# EAGLE design MINI_SAM_TQFP_2.54_BB_2017_01_17_004 (EAGLE 7.6.0)
DESIGNER: BENJAMIN SHOCKLEY; REV: A
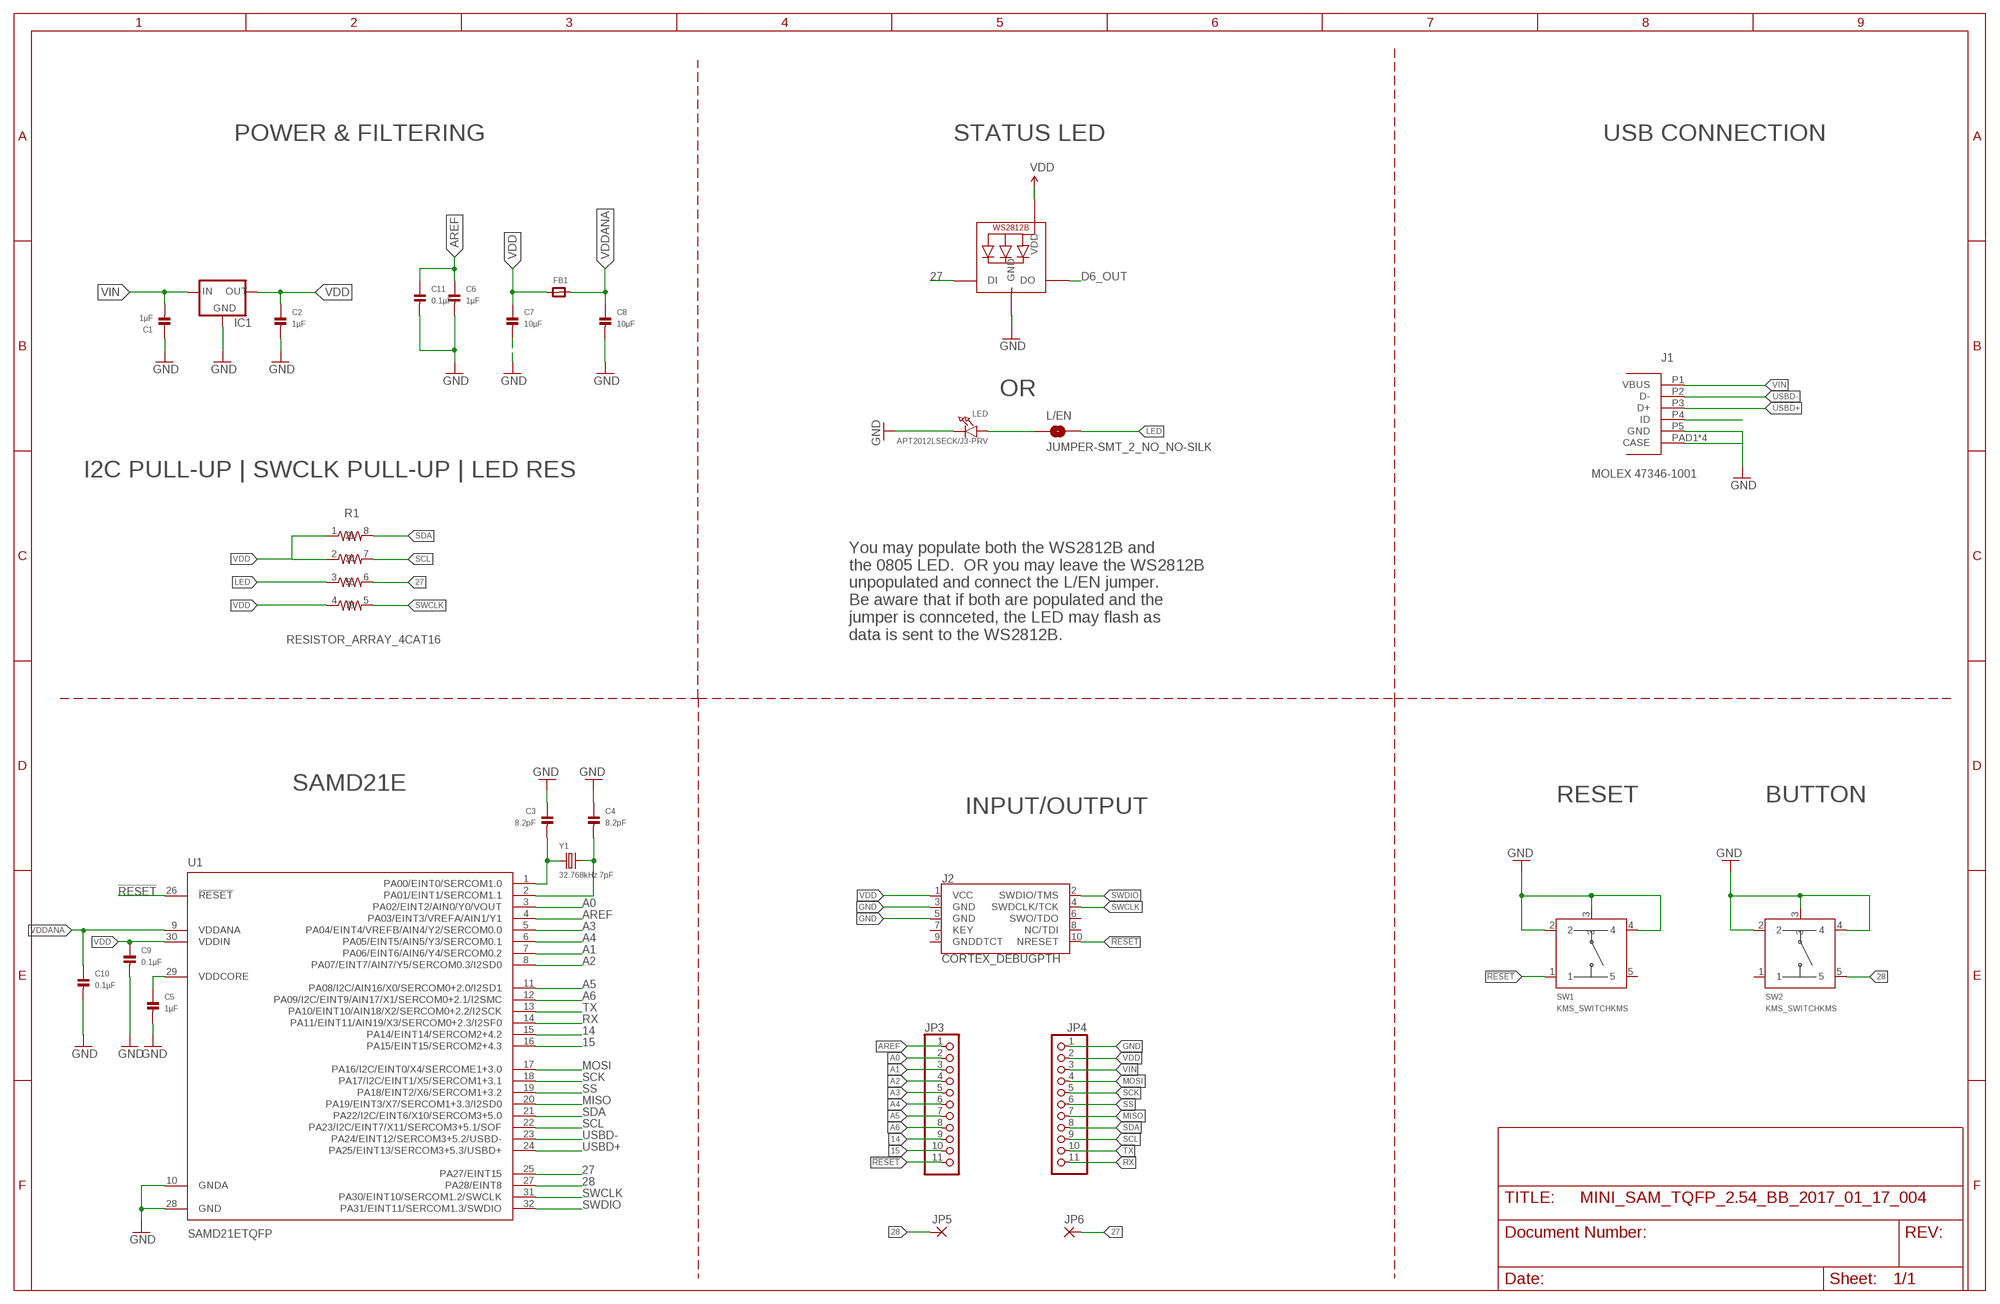
[diagram p0: schematic, sheet 1]

## Parts
C1  1µF  CAP_CERAMIC_0805MP  [_0805MP]
C2  1µF  CAP_CERAMIC_0805MP  [_0805MP]
C3  8.2pF  CAP_CERAMIC_0805MP  [_0805MP]
C4  8.2pF  CAP_CERAMIC_0805MP  [_0805MP]
C5  1µF  CAP_CERAMIC_0805MP  [_0805MP]
C6  1µF  CAP_CERAMIC_0805MP  [_0805MP]
C7  10µF  CAP_CERAMIC_0805MP  [_0805MP]
C8  10µF  CAP_CERAMIC_0805MP  [_0805MP]
C9  0.1µF  CAP_CERAMIC_0805MP  [_0805MP]
C10  0.1µF  CAP_CERAMIC_0805MP  [_0805MP]
C11  0.1µF  CAP_CERAMIC_0805MP  [_0805MP]
FB1  FERRITE_0805MP  [_0805MP]
IC1  MCP1700  [SOT23]
J1  MOLEX_47346-100147346  [MOLEX_47346-1001]
J2  CORTEX_DEBUGPTH  [2X5-PTH-1.27MM]
JP3  PINHD-1X111X11_SMT  [1X11_SMT]
JP4  PINHD-1X111X11_SMT  [1X11_SMT]
JP5  FR11_PAD2.5MMX1.5MM  [SMD2.5MMX1.5MM]
JP6  FR11_PAD2.5MMX1.5MM  [SMD2.5MMX1.5MM]
L/EN  JUMPER-SMT_2_NO_NO-SILK  [SMT-JUMPER_2_NO_NO-SILK]
LED  APT2012LSECK/J3-PRV  LED0805_NOOUTLINE  [CHIPLED_0805_NOOUTLINE]
R1  RESISTOR_ARRAY_4CAT16  [CAT16_ARRAY]
STATUS  WS2812B3535  [LED3535]
SW1  KMS_SWITCHKMS  [KMS_SWITCH]
SW2  KMS_SWITCHKMS  [KMS_SWITCH]
U1  SAMD21ETQFP  [TQFP32-08]
Y1  32.768kHz 7pF  CRYSTAL0805PACKAGE  [_0805MP]

## Nets
14: JP3.9 U1.15(PA14/EINT14/SERCOM2+4.2)
15: JP3.10 U1.16(PA15/EINT15/SERCOM2+4.3)
27: JP6.P$1(P) R1.6 STATUS.1(DI) U1.25(PA27/EINT15)
28: JP5.P$1(P) SW2.5 U1.27(PA28/EINT8)
!RESET: J2.10(NRESET) JP3.11 SW1.1 U1.26(!RESET)
A0: JP3.2 U1.3(PA02/EINT2/AIN0/Y0/VOUT)
A1: JP3.3 U1.7(PA06/EINT6/AIN6/Y4/SERCOM0.2)
A2: JP3.4 U1.8(PA07/EINT7/AIN7/Y5/SERCOM0.3/I2SD0)
A3: JP3.5 U1.5(PA04/EINT4/VREFB/AIN4/Y2/SERCOM0.0)
A4: JP3.6 U1.6(PA05/EINT5/AIN5/Y3/SERCOM0.1)
A5: JP3.7 U1.11(PA08/I2C/AIN16/X0/SERCOM0+2.0/I2SD1)
A6: JP3.8 U1.12(PA09/I2C/EINT9/AIN17/X1/SERCOM0+2.1/I2SMC)
AREF: C6.1 C11.1 JP3.1 U1.4(PA03/EINT3/VREFA/AIN1/Y1)
D6_OUT: STATUS.3(DO)
GND: C1.1 C2.2 C3.1 C4.1 C5.2 C6.2 C7.2 C8.2 C9.2 C10.2 C11.2 IC1.1(GND) J1.P5(GND) J1.PAD1(CASE) J1.PAD2(CASE) J1.PAD3(CASE) J1.PAD4(CASE) J2.3(GND) J2.5(GND) JP4.1 LED.C STATUS.4(GND) SW1.2 SW1.3 SW1.4 SW2.2 SW2.3 SW2.4 U1.10(GNDA) U1.28(GND)
LED: L/EN.2 R1.3
MISO: JP4.7 U1.20(PA19/EINT3/X7/SERCOM1+3.3/I2SD0)
MOSI: JP4.4 U1.17(PA16/I2C/EINT0/X4/SERCOME1+3.0)
N$1: C3.2 U1.1(PA00/EINT0/SERCOM1.0) Y1.1
N$2: L/EN.1 LED.A
N$5: C4.2 U1.2(PA01/EINT1/SERCOM1.1) Y1.2
N$9: C5.1 U1.29(VDDCORE)
N$10: J1.P4(ID)
RX: JP4.11 U1.14(PA11/EINT11/AIN19/X3/SERCOM0+2.3/I2SF0)
SCK: JP4.5 U1.18(PA17/I2C/EINT1/X5/SERCOM1+3.1)
SCL: JP4.9 R1.7 U1.22(PA23/I2C/EINT7/X11/SERCOM3+5.1/SOF)
SDA: JP4.8 R1.8 U1.21(PA22/I2C/EINT6/X10/SERCOM3+5.0)
SS: JP4.6 U1.19(PA18/EINT2/X6/SERCOM1+3.2)
SWCLK: J2.4(SWDCLK/TCK) R1.5 U1.31(PA30/EINT10/SERCOM1.2/SWCLK)
SWDIO: J2.2(SWDIO/TMS) U1.32(PA31/EINT11/SERCOM1.3/SWDIO)
TX: JP4.10 U1.13(PA10/EINT10/AIN18/X2/SERCOM0+2.2/I2SCK)
USBD+ [USB_DATA]: J1.P3(D+) U1.24(PA25/EINT13/SERCOM3+5.3/USBD+)
USBD- [USB_DATA]: J1.P2(D-) U1.23(PA24/EINT12/SERCOM3+5.2/USBD-)
VDD: C2.1 C7.1 C9.1 FB1.1 IC1.2(OUT) J2.1(VCC) JP4.2 R1.1 R1.2 R1.4 STATUS.2(VDD) U1.30(VDDIN)
VDDANA: C8.1 C10.1 FB1.2 U1.9(VDDANA)
VIN: C1.2 IC1.3(IN) J1.P1(VBUS) JP4.3
Unconnected: J2.6(SWO/TDO) J2.7(KEY) J2.8(NC/TDI) J2.9(GNDDTCT) SW1.5 SW2.1

## Notes on the sheet
- POWER & FILTERING | STATUS LED | USB CONNECTION
- OR
- I2C PULL-UP | SWCLK PULL-UP | LED RES | MOLEX 47346-1001
- You may populate both the WS2812B and
  the 0805 LED.  OR you may leave the WS2812B
  unpopulated and connect the L/EN jumper.
  Be aware that if both are populated and the
  jumper is connceted, the LED may flash as
  data is sent to the WS2812B.
- SAMD21E
- RESET | BUTTON
- INPUT/OUTPUT

## Library data of the parts
C1-C11 = microbuilder:CAP_CERAMIC: Ceramic Capacitors 0402 - 0402 Surface Mount Capacitors 16pF 50V 5% [Digikey: 445-4899-2-ND] 18pF 50V 5% [Digikey: 490-1281-2-ND] 22pF 50V 5% [Digikey: 490-1283-2-ND] 68pF 50V 5% [Digikey: 490-1289-2-ND] 0.1uF 10V 10% [Digikey: 490-1318-2-ND] 1.0uF 6.3V 10% [Digikey: 490-1320-2-ND] 0603 - 0603 Surface Mount Capacitors 16 pF 50V 5% [Digikey: 445-5051-2-ND] 22 pF 50V [Digikey: PCC220ACVTR-ND] 33 pF 50V 5% [Digikey: 490-1415-1-ND] 56pF 50V 5% [Digikey: 490-1421-1-ND] 220pF 50V 5% [Digikey: 445-1285-1-ND] 680 pF 50V 2200 pF 50V 5% C0G [Digikey: 445-1297-1-ND] 5600 pF 100V 5% X7R [Digikey: 478-3711-1-ND] 0.1 µF 25V 10% [Digikey: PCC2277TR-ND] 0.22 µF 16V 10% X7R [Digikey: 445-1318-1-ND] 1.0 µF 25V 10% [Digikey: 445-5146-2-ND] 0603 - RF Specific 3pF 250V +/-0.1pF RF [Digikey: 712-1347-1-ND] 18 pF 250V 5% [Digikey: 478-3505-1-ND or 712-1322-1-ND] 56 pF 250V 5% C0G RF [Digikey: 490-4867-1-ND] 68 pF 250V RF [Digikey: 490-4868-1-ND] 0805 - 0805 Surface Mount Capacitors 220 pF 250V 2% RF Ceramic Capacitor [Digikey: 712-1398-1-ND] 1000 pF 50V 2% NP0 Ceramic Capacitor [Digikey: 478-3760-1-ND] 0.1 µF 25V 10% Ceramic Capacitor [Digikey: PCC1828TR-ND] 1.0 µF 16V 10% Ceramic Capacitor[Digikey: 490-1691-2-ND] 10.0 µF 10V 10% Ceramic Capacitor[Digikey: 709-1228-1-ND] 10.0 uF 16V 10% Ceramic Capacitor [Digikey: 478-5165-2-ND] 47 uF 6.3V 20% Ceramic Capacitor [Digikey: 587-1779-1-ND or 399-5506-1-ND] 1206 - 1206 Surface Mount Capacitors 47uF 10V 20% Ceramic Capacitor [Digikey: 490-5528-1-ND or 399-5508-1-ND or 445-6010-1-ND] 100uF 6.3V -20%, +80% Y5V Ceramic Capacitor (Digikey: 490-4512-1-ND, Mouser: 81-GRM31CF50J107ZE1L)
FB1 = microbuilder:FERRITE: Ferrite Bead 0603 MMZ1608B121C - 120 Ohm @ 100MHz, 600mA, 0.15 Ohm DC Resistance - Digikey: 445-2164-1-ND BK1608HW121-T - 120 Ohm, 600mA Ferrite Chip - Digikey: 587-1876-2-ND 0805 HZ0805B272R-10 - 2.7K Ohm @ 100MHz, 200mA, 0.8 Ohm DC Resistance - Digikey: 240-2504-1-ND (see also Murata BLM21BD272SN1L) MMZ2012Y152B - 1.5K Ohm @ 100MHz, 500mA, 0.4 Ohm DC Resistance - Digikey: 445-1560-1-ND - Mainly for high frequency (80-400MHz) MMZ2012R102A - 1K Ohm @ 100MHz, 500mA, 0.3 Ohm DC Resistance - Digikey: 445-1555-2-ND - More general purpose (10-200MHz)
IC1 = Shockley_Custom:MCP1700: VOLTAGE REGULATOR
J1 = Shockley_Custom:MOLEX_47346-1001
J2 = SparkFun-Connectors:CORTEX_DEBUG: Cortex Debug Connector Datasheet <http://infocenter.arm.com/help/topic/com.arm.doc.faqs/attached/13634/cortex_debug_connectors.pdf>
JP3 JP4 = pinhead+:PINHD-1X11: PIN HEADER
JP5 JP6 = Shockley_Custom:FR11_PAD
L/EN = SparkFun-Jumpers:JUMPER-SMT_2_NO: Normally open jumper This jumper has two pads in close proximity to each other. Apply solder to close the connection. Round pads are easier to solder for beginners, but are a lot larger. SparkFun Product that uses the round pads: SparkFun EL Sequencer <https://www.sparkfun.com/products/12781>
LED = microbuilder:LED: LED 0603 - 0603 Surface Mount Package 2mA: Green LED - Low Power (3.9mcd, 2ma, 1.7Vf) - Digikey: 475-2709-2-ND Orange LED - Low Power (9.8mcd, 2ma, 1.8Vf) - Digikey: 475-1194-2-ND Red LED - Low Power (5mcd, 2ma, 1.8Vf) - Digikey: 475-1195-2-ND Yellow LED - Low Power (7mcd, 2ma, 1.8Vf) - Digikey: 475-1196-2-ND 5mA: Blue LED - Low Power (17mcd, 5ma, 2.9Vf) - Digikey: LNJ937W8CRACT-ND 0805 - 0805 Surface Mount Package 2mA: Red LED (8.8mcd, 2mA, 1.8Vf, Clear) - Low Power [Digikey: 475-2510-1-ND] Green LED (5mcd, 2mA, 1.8Vf, Clear) - Low Power [Digikey: 475-2730-1-ND] Yellow LED (11.3mcd, 2mA, 1.8Vf, Clear) - Low Power [Digikey: 475-2555-1-ND] 20mA: Red LED (104mcd, 20mA, Diffused) - LS R976 [Digikey: 475-1278-6-ND] Red LED (12mcd, 20mA, 2.0Vf, Clear) - APT2012EC [Digikey: 754-1128-1-ND] Green LED (15mcd, 20mA, 2.2Vf, Clear) - APT2012GC [Digikey: 754-1131-1-ND] Orange LED (160mcd, 20mA, 2.1Vf, Clear) - APT2012SECK [Digikey: 754-1130-1-ND] 1206 - 1206 Surface Mount Package Green LED (26mcd, 20mA, Diffused) - LG N971 [Digikey: 475-1407-6-ND] Red LED (15mcd, 20mA, Diffused) - LH N974 [Digikey: 475-1416-6-ND]
R1 = Shockley_Custom:RESISTOR_ARRAY_4
STATUS = adafruit:WS2812B
SW1 SW2 = Shockley_Custom:KMS_SWITCH
U1 = Shockley_Custom:SAMD21E
Y1 = Shockley_Custom:CRYSTAL: Crystals HC49UP - Surface Mount Crystal 4.0MHz 18pF +/-30ppm Surface Mount Crystal [Digikey: 535-9857-1-ND] 12.0 MHz Surface Mount Crystal [Digikey: 535-9869-6-ND] 25.0 MHz Surface Mount Crystal [Digikey: 535-9078-1-ND] 2.5 x 2.0mm - MEMs SMT Crystal 16.0 MHz 10pF 20ppm 2.5 x 2.0mm Crystal [Digikey -40-85°C: 535-10923-1-ND] 3.2 x 2.5mm - MEMs SMT Crystal 12.0 MHz 8pF 15ppm 3.2 x 2.5mm Crystal [Digikey: -10-70°C: 644-1047-1-ND -40-125°C: 644-1128-1-ND] 16.0 MHz 8pF 15ppm 3.2 x 2.5mm Crystal [Digikey: -10-70°C: 644-1049-1-ND -40-125°C: 644-1129-2-ND] 16.0 MHz 10pF 10ppm 3.2 x 2.5mm Crystal [Digikey: 644-1100-1-ND] 27.12 MHz 18pF 30ppm 3.2 x 2.5mm Crystal [Digikey: 887-1424-1-ND] 27.12MHz 10pF 10ppm 3.2 x 2.5mm Crystal [Digikey: 887-1329-1-ND] 4.9 x 1.8mm - MEMs SMT Crystal 32.768 KHz 12.5pF 20ppm 4.9 x 1.8mm Crystal [Digikey: SE2415CT-ND] 8.0 x 3.8mm - Surface Mount Crystal 32.768kHz 12.5pF 20ppm -40°C-85°C [Digikey: 535-9166-2-ND] Cylinder 32.768KHz Cylinder Crystal (2x6mm body) [Ex. Digikey: 300-8341-2-ND]

## Board
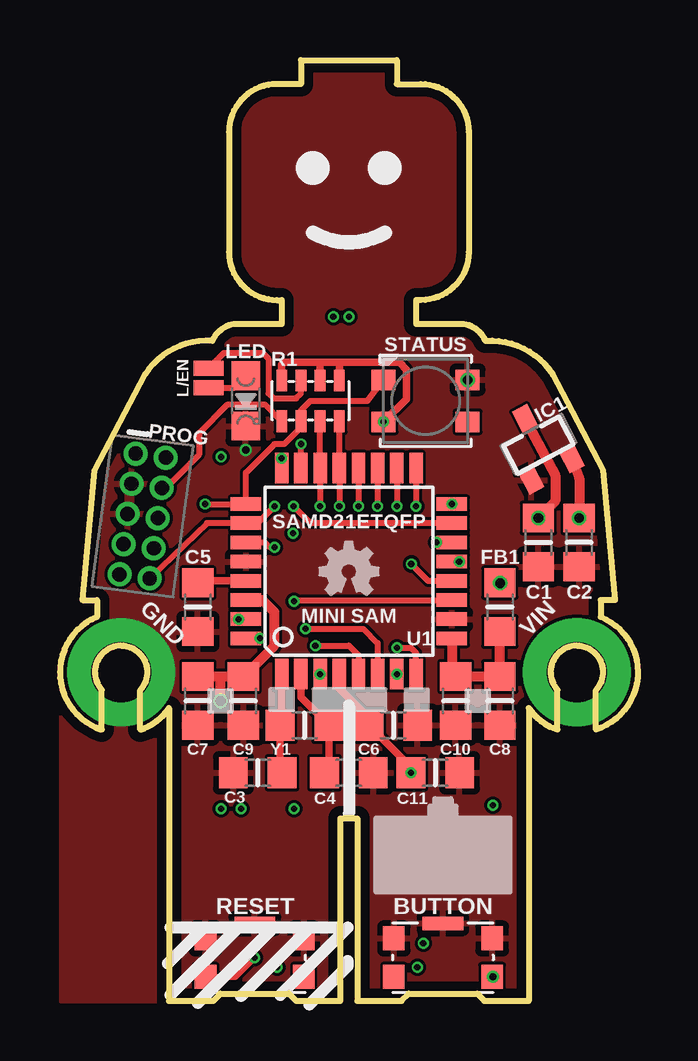
[diagram p1: board, top side]
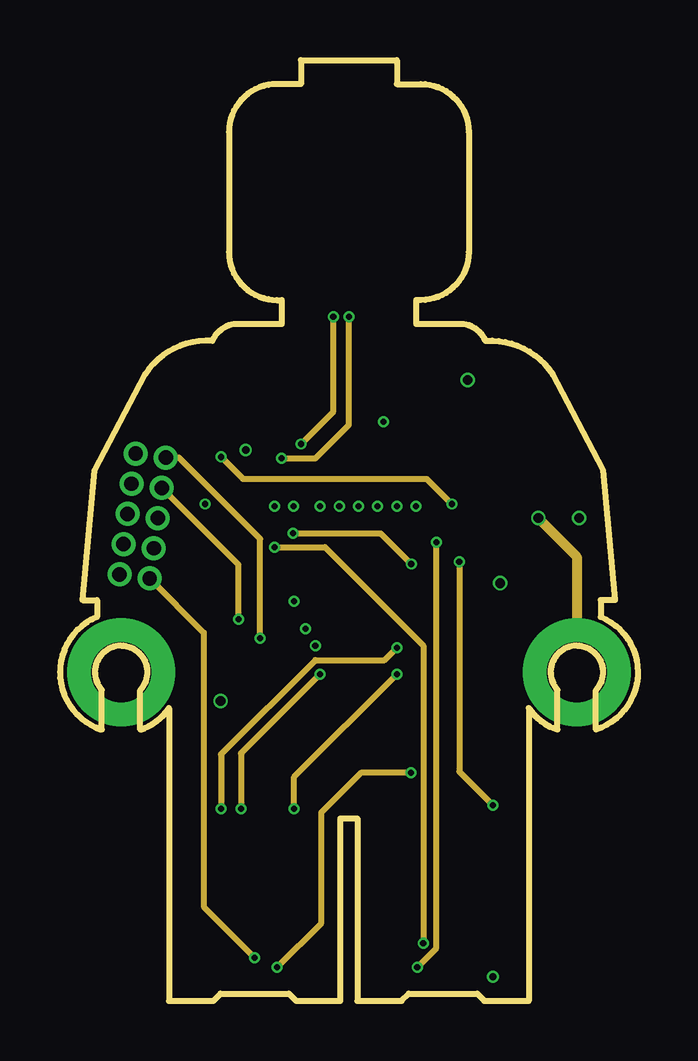
[diagram p2: board, inner layer Route2]
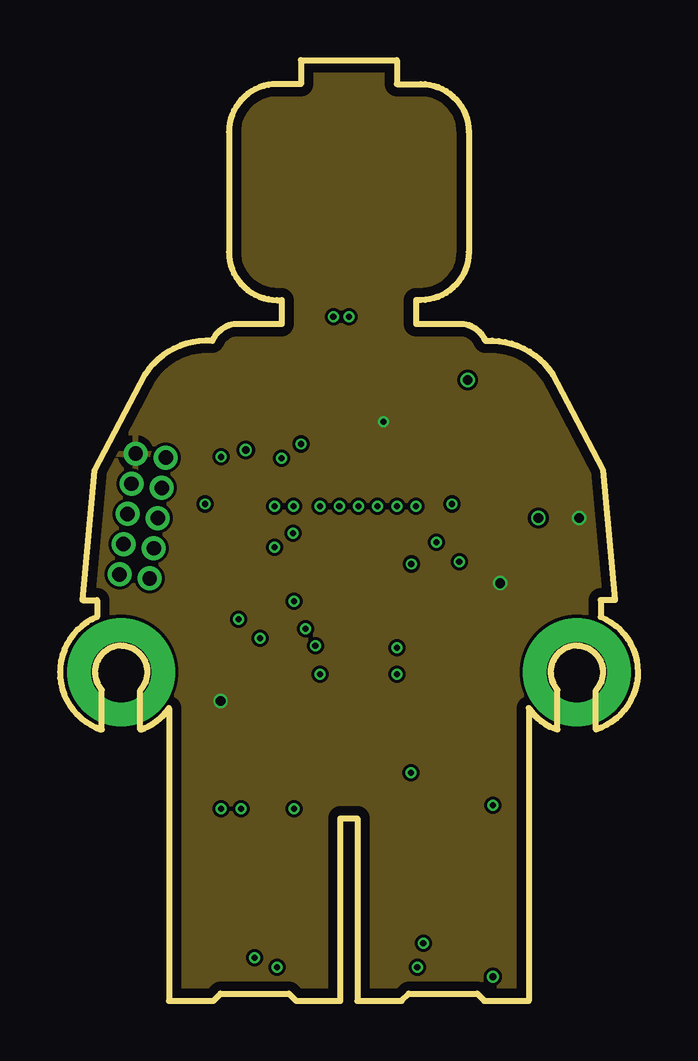
[diagram p3: board, inner layer Route15]
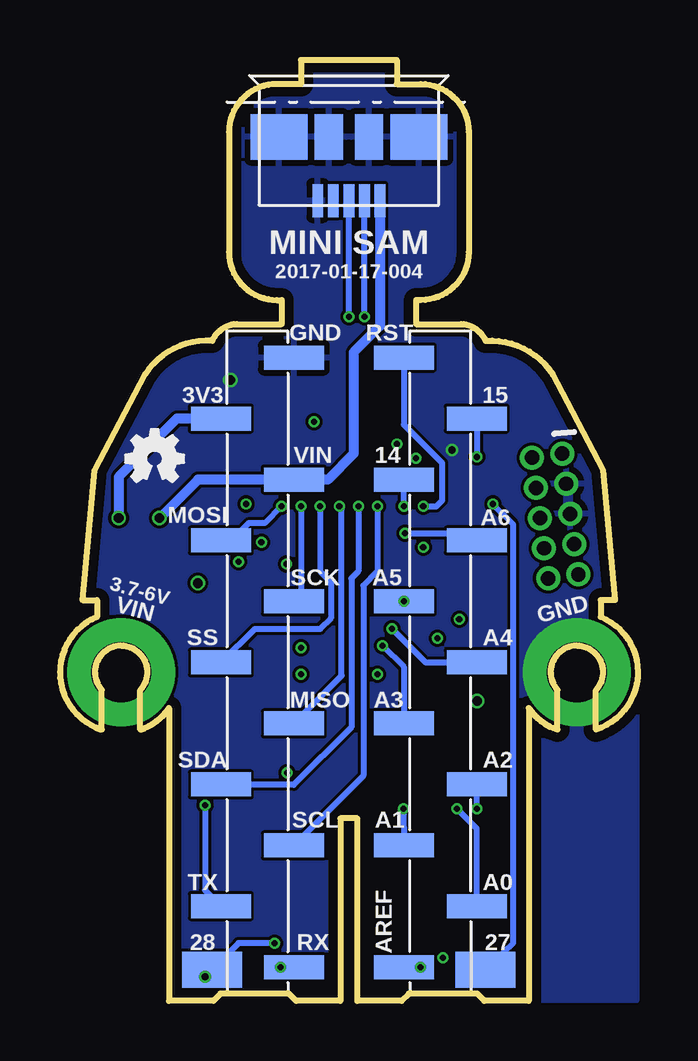
[diagram p4: board, bottom side, seen from below]

Size 24.1 x 39.2 mm. Coordinates in mm from the lower left corner, seen from the top.
Outline: 4.55,12.2 4.55,0 6.4,0 6.7,0.3 9.55,0.3 9.85,0 11.7,0 11.7,7.6 12.4,7.6 12.4,0 14.25,0 14.55,0.3 17.4,0.3 17.7,0 19.55,0 19.55,12.2
Outline: 4.55,12.2 arc-28 3.65,11.4
Outline: 4.55,12.2 arc-40 3.35,11.3 3.35,12.95 arc132 2.55,14.8 arc132 1.75,12.95 1.75,11.3 arc-140 1.55,16 1.55,16.7 0.95,16.7 1.45,22.1 3.55,26.1 arc-60 6.35,27.5 arc-63 7.37,28.2 9.25,28.2 9.25,29.2 9.05,29.2 arc-90 7.05,31.2 7.05,36.2 arc-90 9.05,38.2 10.05,38.2 10.05,39.2 14.05,39.2 14.05,38.2 15.05,38.2 arc-90 17.05,36.2 17.05,31.2 arc-90 15.05,29.2 14.85,29.2 14.85,28.2 16.73,28.2 arc-63 17.75,27.5 arc-60 20.55,26.1 22.65,22.1 23.15,16.7 22.55,16.7 22.55,16 arc-140 22.35,11.3 22.35,12.95 arc132 21.55,14.8 arc132 20.75,12.95 20.75,11.3 arc-40 19.55,12.2
Outline: 19.55,12.2 arc28 20.45,11.4
Copper layers (1*2*15*16): Top 0.035559375mm / dielectric 0.17018125mm / Route2 0.01778125mm / dielectric 47mil / Route15 0.01778125mm / dielectric 0.17018125mm / Bottom 0.035559375mm
Design rules "OSHPark-4layer *": minimum track width 5mil, minimum drill 10mil, track to track 5mil, track to pad 5mil, pad to pad 5mil, via to via 5mil, smd to smd 5mil, copper to edge 15mil, drill to drill 6mil, minimum pad ring 4mil, minimum via ring 4mil, stop-mask expansion 2.5mil, vias tented up to drill 28mil, thermal gap 10mil

### Footprints (pad centres in the part's own frame; a part is rotated, then mirrored left to right if it is on the bottom)
_0805MP = smd 1.2 x 1.3: 1 -1.016,0; 2 1.016,0
SOT23 = smd 0.7 x 1: 1 -0.95,-1.2; 2 0.95,-1.2; 3 0,1.2
MOLEX_47346-1001 = smd 0.45 x 1.38: P1 1.3,-2.66; P2 0.65,-2.66; P3 0,-2.66; P4 -0.65,-2.66; P5 -1.3,-2.66 | smd 2.375 x 1.9: PAD1 -2.913,0; PAD4 2.913,0 | smd 1.175 x 1.9: PAD2 -0.838,0; PAD3 0.838,0
2X5-PTH-1.27MM = drill 0.6 pad 1: 1 -2.54,-0.635; 2 -2.54,0.635; 3 -1.27,-0.635; 4 -1.27,0.635; 5 0,-0.635; 6 0,0.635; 7 1.27,-0.635; 8 1.27,0.635; 9 2.54,-0.635; 10 2.54,0.635
1X11_SMT = smd 1 x 2.5: 1 -12.7,1.52; 2 -10.16,-1.52; 3 -7.62,1.52; 4 -5.08,-1.52; 5 -2.54,1.52; 6 0,-1.52; 7 2.54,1.52; 8 5.08,-1.52; 9 7.62,1.52; 10 10.16,-1.52; 11 12.7,1.52
SMD2.5MMX1.5MM = smd 1.5 x 2.5: P$1 0,0
SMT-JUMPER_2_NO_NO-SILK = smd 0.635 x 1.27: 1 -0.406,0; 2 0.406,0
CHIPLED_0805_NOOUTLINE = smd 1.2 x 1.2: A 0,-1.05; C 0,1.05
CAT16_ARRAY = smd 0.45 x 0.9: 1 -1.2,-0.85; 2 -0.4,-0.85; 3 0.4,-0.85; 4 1.2,-0.85; 5 1.2,0.85; 6 0.4,0.85; 7 -0.4,0.85; 8 -1.2,0.85
LED3535 = smd 1 x 0.85: 1 -1.75,0.875; 2 -1.75,-0.875; 3 1.75,-0.875; 4 1.75,0.875
KMS_SWITCH = smd 0.9 x 1: 1 -2.05,-0.8; 2 -2.05,0.8; 4 2.05,0.8; 5 2.05,-0.8 | smd 1.7 x 0.55: 3 0,1.425
TQFP32-08 = smd 1.27 x 0.559: 1 -4.293,2.8; 2 -4.293,2; 3 -4.293,1.2; 4 -4.293,0.4; 5 -4.293,-0.4; 6 -4.293,-1.2; 7 -4.293,-2; 8 -4.293,-2.8; 17 4.293,-2.8; 18 4.293,-2; 19 4.293,-1.2; 20 4.293,-0.4; 21 4.293,0.4; 22 4.293,1.2; 23 4.293,2; 24 4.293,2.8 | smd 0.559 x 1.27: 9 -2.8,-4.293; 10 -2,-4.293; 11 -1.2,-4.293; 12 -0.4,-4.293; 13 0.4,-4.293; 14 1.2,-4.293; 15 2,-4.293; 16 2.8,-4.293; 25 2.8,4.293; 26 2,4.293; 27 1.2,4.293; 28 0.4,4.293; 29 -0.4,4.293; 30 -1.2,4.293; 31 -2,4.293; 32 -2.8,4.293

### Placement (x,y rotation side)
C1  19.95,19.1 90 top
C2  21.65,19.1 270 top
C3  8.25,9.5 0 top
C4  12.05,9.5 180 top
C5  5.75,16.4 270 top
C6  13.9,11.48 0 top
C7  5.75,12.5 270 top
C8  18.35,12.5 270 top
C9  7.65,12.5 270 top
C10  16.5,12.5 270 top
C11  15.65,9.5 0 top
FB1  18.35,16.4 270 top
IC1  19.95,23.2 27.7 top
J1  12.05,36 0 bottom
J2  3.45,20.2 262.4 top
JP3  8.24,14.1 90 bottom
JP4  15.86,14.1 270 bottom
JP5  17.75,1.3 90 bottom
JP6  6.35,1.3 270 bottom
L/EN  6.2,25.95 90 top
LED  7.75,25 180 top
R1  10.45,25 180 top
STATUS  15.25,25 0 top
SW1  8.12,1.8 0 top
SW2  15.97,1.8 0 top
U1  12.05,17.9 90 top
U$1  [OSHW-LOGO-MINI]  12.05,17.9 0 top
U$2  [OSHW-LOGO-MINI]  20.15,22.6 0 bottom
Y1  10.2,11.48 0 top

### Tracks (layer width: path | path; a pad name or v marks a point on that pad's centre or on a via)
14  (via drill 0.25)
  Top 0.254: U1.15 10.45,19.9 v9.75,20.6
  Bottom 0.254: v9.75,20.6 JP3.9
15  (via drill 0.25)
  Route2 0.254: v6.72,22.66 7.63,21.75 15.29,21.75 U1.16
  Bottom 0.254: JP3.10 v6.72,22.66
  other vias: 16.34,20.7
27  (via drill 0.25)
  Top 0.254: STATUS.1 12.82,25 10.45,25 10.05,24.6 R1.6 10.05,23.9 9.35,23.2 8.95,23.2 7.75,22.01 U1.25 v6.05,20.7
  Bottom 0.254: JP6.P$1 5.2,2.4 5.2,19.85 v6.05,20.7
28  (via drill 0.25, 0.3)
  Top 0.254: U1.27 8.55,19.1 8.75,18.9 v8.95,18.9 | v18.05,1 SW2.5
  Route2 0.254: v8.95,18.9 11.05,18.9 15.15,14.8 v15.15,2.4
  Bottom 0.254: v18.05,1 JP5.P$1 16.65,2.4 v15.15,2.4
!RESET  (via drill 0.25)
  Top 0.254: J2.10 6.13,19.9 U1.26 8.25,19.9 v8.95,20.6 | SW1.1 7.32,1 v8.12,1.8
  Route2 0.254: J2.10 6,15.34 6,3.92 v8.12,1.8
  Bottom 0.254: JP3.11 9.76,24.01 8.15,22.4 8.15,20.85 8.4,20.6 v8.95,20.6
A0  (via drill 0.25)
  Route2 0.254: U1.3 7.55,10.31 v7.55,8
  Bottom 0.254: JP3.2 6.72,7.17 v7.55,8
  other vias: 10.85,13.61
A1  (via drill 0.25)
  Route2 0.254: U1.7 9.77,9.33 v9.77,8
  Bottom 0.254: v9.77,8 JP3.3
  other vias: 14.05,13.61
A2  (via drill 0.25)
  Top 0.254: U1.8 14.85,14.5 14.65,14.7 v14.05,14.7 v14.05,14.71
  Route2 0.254: v6.72,8 6.72,10.27 10.65,14.2 13.54,14.2 v14.05,14.71
  Bottom 0.254: v6.72,8 JP3.4
A3  (via drill 0.25)
  Top 0.254: v10.65,14.8 12.05,14.8 12.45,14.4 U1.5
  Bottom 0.254: v10.65,14.8 9.76,13.91 JP3.5
A4  (via drill 0.25)
  Top 0.254: v10.25,15.5 12.65,15.5 13.25,14.9 U1.6
  Bottom 0.254: v10.25,15.5 8.85,14.1 JP3.6
A5  (via drill 0.25)
  Top 0.254: JP3.7 9.82,16.7 U1.11
  other vias: 9.76,16.64
A6  (via drill 0.25)
  Top 0.254: v14.65,18.2 15.35,17.5 U1.12
  Route2 0.254: v14.65,18.2 13.37,19.48 v9.72,19.48
  Bottom 0.254: v9.72,19.48 7.02,19.48 JP3.8
AREF  (via drill 0.25)
  Top 0.305: U1.4 11.65,13 12.88,11.77 C6.1 14.63,9.73 C11.1
  Route2 0.254: v9.06,1.4 10.9,3.24 10.9,7.85 12.55,9.5 C11.1
  Bottom 0.254: JP3.1 v9.06,1.4
  other vias: 14.63,9.5
GND  (via drill 0.3, 0.4, 2.5 pad 4.5)
  other vias: 2.55,13.7 17,25.88 7.75,22.95
  pour Top: 0.05,0 24.05,0 24.05,39.2 0.05,39.2
  pour Bottom: 0.05,0 24.05,0 24.05,39.2 0.05,39.2
LED
  Top 0.254: R1.3 10.05,25.3 9.85,25.1 8.9,25.1 8.7,25.3 8.7,26.75 8.45,27 6.84,27 L/EN.2
MISO  (via drill 0.25)
  Top 0.254: U1.20 v12.45,20.6
  Bottom 0.254: JP4.7 12.35,13.55 12.35,20.5 v12.45,20.6
MOSI  (via drill 0.25)
  Top 0.254: U1.17 v14.85,20.6
  Bottom 0.254: 16.47,19.18 16.95,19.18 JP4.4 | v14.85,20.6 15.55,19.9 16.23,19.9 16.63,19.5
  Bottom 0.305: 16.63,19.5 arc-90 16.95,19.18
N$1
  Top 0.305: U1.1 9.25,11.55 Y1.1 9.18,9.58 C3.2
N$2
  Top 0.254: L/EN.1 7.24,25.54 LED.A
N$5
  Top 0.305: U1.2 10.05,12.65 Y1.2 11.21,9.68 C4.2
N$9
  Top 0.254: 5.81,17.5 C5.1
  Top 0.305: U1.29 5.81,17.5
RX  (via drill 0.25)
  Top 0.305: v15.7,19.1 U1.14
  Route2 0.254: v14.9,1.4 15.7,2.2 v15.7,19.1
  Bottom 0.254: JP4.11 v14.9,1.4
SCK  (via drill 0.25)
  Top 0.254: U1.18 v14.05,20.6
  Bottom 0.254: v14.05,20.6 14.05,17.12 JP4.5
SCL  (via drill 0.25)
  Top 0.254: v10.85,20.6 U1.22 R1.7
  Bottom 0.254: v10.85,20.6 10.85,17.9 11.45,17.3 11.45,9.37 JP4.9
SDA  (via drill 0.25)
  Top 0.254: v11.65,20.6 U1.21 R1.8
  Bottom 0.254: 16.97,9.02 JP4.8 17.55,9 14.35,9 11.95,11.4 11.95,17.6 11.65,17.9 v11.65,20.6
SS  (via drill 0.25)
  Top 0.254: U1.19 v13.25,20.6
  Bottom 0.254: JP4.6 15.97,15.5 13.25,15.5 12.8,15.95 12.8,17.45 13.25,17.9 v13.25,20.6
SWCLK  (via drill 0.25)
  Top 0.254: U1.31 v7.45,15.9 | 9.25,23.9 R1.5 8.55,24.85 7,24.85 5.8,23.65 5.8,22.75 4.42,21.38 J2.4
  Route2 0.254: v7.45,15.9 7.45,18.17 J2.4
SWDIO  (via drill 0.25)
  Top 0.203: U1.32 v8.35,15.1
  Route2 0.254: v8.35,15.1 8.35,19.25 4.96,22.63 J2.2
TX  (via drill 0.25)
  Top 0.305: U1.13 v16.65,18.3
  Route2 0.254: v16.65,18.3 16.65,9.55 v18.05,8.15
  Bottom 0.254: v18.05,8.15 18.05,4.61 JP4.10
USBD+  (via drill 0.25)
  Top 0.254: U1.24 v9.25,22.6
  Route2 0.254: v9.25,22.6 10.65,22.6 12.05,24 v12.05,28.5
  Bottom 0.254: v12.05,28.5 J1.P3
USBD-  (via drill 0.25)
  Top 0.254: U1.23 v10.05,23.2
  Route2 0.254: v10.05,23.2 11.4,24.55 v11.4,28.5
  Bottom 0.254: v11.4,28.5 J1.P2
VDD  (via drill 0.25, 0.4)
  Top 0.254: v18.35,17.4 FB1.1 | C9.1 7.83,14 8.15,14
  Top 0.305: R1.4 9.25,26.5 9.35,26.6 10.85,26.6 | 10.85,26.6 11.65,26.6 | 11.65,26.6 14.15,26.6 14.45,26.3 14.45,25.07 STATUS.2 | R1.2 10.85,26.6 | R1.1 11.65,26.6
  Top 0.406: IC1.2 21.65,21.78 C2.1 | 8.15,14 8.95,14.8 8.95,16.2 8.45,16.7 U1.30 | C7.1 6.7,13.52 | 6.7,13.52 C9.1 | v6.7,12.5 6.7,13.52
  Bottom 0.406: JP4.2 19.22,24.26 21.65,21.83 C2.1
  other vias: 21.65,20.12 13.5,24.12
  pour Route15 (rank 3): 0.05,0 24.05,0 24.05,40 0.05,40
VDDANA
  Top 0.406: FB1.2 C8.1 C10.1 16.34,13.67 U1.9
VIN  (via drill 0.4, 2.5 pad 4.5)
  Top 0.406: IC1.3 20.65,21.9 20.65,20.82 C1.2
  Route2 0.406: C1.2 21.55,18.5 v21.55,13.7
  Bottom 0.406: J1.P1 10.75,28.12 11.85,27.02 11.85,22.8 12.93,21.72 JP4.3 18.34,21.72 C1.2
  other vias: 19.95,20.12

### Text on the board
tPlace: R1 | GND | VIN | U1
tNames: PROG | MINI SAM | RESET | BUTTON
bNames: MINI SAM | 2017-01-17-004 | RST | GND | 15 | 3V3 | 14 | VIN | A6 | MOSI | A5 | SCK | 3.7-6V | GND | VIN | A4 | SS | A3 | MISO | A2 | SDA | A1 | SCL | A0 | TX | AREF | 27 | RX | 28
tStop: MINI | SAM